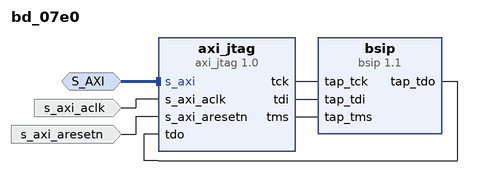
[diagram p0: block diagram of the top level]
# Vivado block design bd_07e0, xc7z010clg400-1, Vivado 2023.2
create_bd_design bd_07e0

create_bd_intf_port -mode Slave -vlnv xilinx.com:interface:aximm_rtl:1.0 S_AXI
set_property -dict {CONFIG.ADDR_WIDTH 16 CONFIG.ASSOCIATED_BUSIF S_AXI} [get_bd_intf_ports S_AXI]
create_bd_port -dir I -type clk s_axi_aclk
set_property -dict {CONFIG.ASSOCIATED_RESET s_axi_aresetn:s_axi_lite_resetn} [get_bd_ports s_axi_aclk]
create_bd_port -dir I -type rst s_axi_aresetn
set_property -dict {CONFIG.POLARITY ACTIVE_LOW} [get_bd_ports s_axi_aresetn]

create_bd_cell -type ip -vlnv xilinx.com:ip:axi_jtag:1.0 axi_jtag
set_property -dict [list \
  CONFIG.C_S_AXI_ADDR_WIDTH 5 \
  CONFIG.C_S_AXI_DATA_WIDTH 32 \
  CONFIG.C_TCK_CLOCK_RATIO 8 \
  CONFIG.C_USE_MUX_STATUS false \
] [get_bd_cells axi_jtag]
create_bd_cell -type ip -vlnv xilinx.com:ip:bsip:1.1 bsip
set_property -dict [list \
  CONFIG.C_CHIP_ID 0 \
  CONFIG.C_DEVICE_FAMILY 0 \
  CONFIG.C_EN_MUX 0 \
  CONFIG.C_EN_MUX_EXT_BS 0 \
  CONFIG.C_IR_ID_INSTR 0 \
  CONFIG.C_IR_USER1_INSTR 0 \
  CONFIG.C_IR_WIDTH 0 \
  CONFIG.C_USER_SCAN_CHAIN 1 \
  CONFIG.C_USE_SOFTBSCAN 1 \
] [get_bd_cells bsip]

# ---- connections ----

connect_bd_intf_net [get_bd_intf_ports S_AXI] [get_bd_intf_pins axi_jtag/s_axi]
connect_bd_net [get_bd_pins axi_jtag/tck] [get_bd_pins bsip/tap_tck]
connect_bd_net [get_bd_pins axi_jtag/tdi] [get_bd_pins bsip/tap_tdi]
connect_bd_net [get_bd_pins axi_jtag/tms] [get_bd_pins bsip/tap_tms]
connect_bd_net [get_bd_pins bsip/tap_tdo] [get_bd_pins axi_jtag/tdo]
connect_bd_net [get_bd_ports s_axi_aclk] [get_bd_pins axi_jtag/s_axi_aclk]
connect_bd_net [get_bd_ports s_axi_aresetn] [get_bd_pins axi_jtag/s_axi_aresetn]

# ---- address map ----
assign_bd_address -offset 0x0000 -range 64K -target_address_space [get_bd_addr_spaces S_AXI] [get_bd_addr_segs axi_jtag/s_axi/reg0]

validate_bd_design
save_bd_design
